# EAGLE schematic bdm80 (EAGLE 9.6.2)
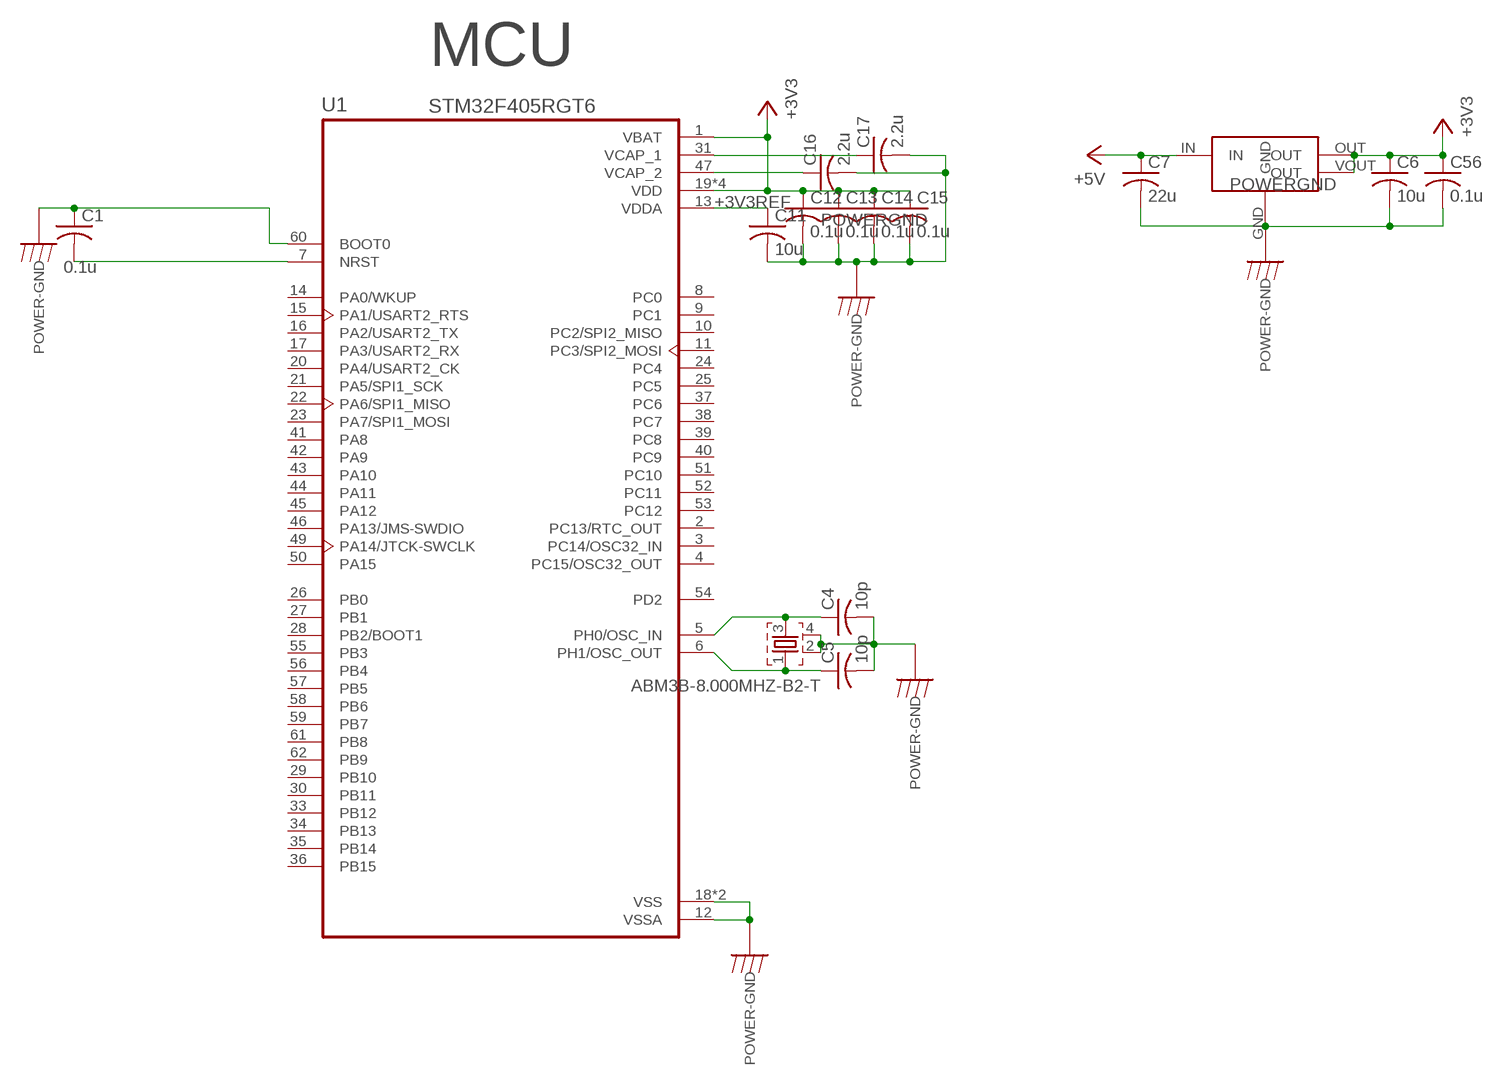
[diagram p0: schematic, sheet 1]

## Parts
C1  0.1u  C-2012  [2012-C]
C4  10p  C-1608  [1608]
C5  10p  C-1608  [1608]
C6  10u  C-2012  [2012-C]
C7  22u  C-2012  [2012-C]
C11  10u  C-2012  [2012-C]
C12  0.1u  C-2012  [2012-C]
C13  0.1u  C-2012  [2012-C]
C14  0.1u  C-2012  [2012-C]
C15  0.1u  C-2012  [2012-C]
C16  2.2u  C-2012  [2012-C]
C17  2.2u  C-2012  [2012-C]
C56  0.1u  C-2012  [2012-C]
IC1  AZ1086H-3.3  [SOT223]
U1  STM32F405RGT6  [LQFP64]
X1  ABM3B-8.000MHZ-B2-T  [ABM3B-8.000MHZ-B2-T]

## Nets
+3V3: C6.1 C12.1 C13.1 C14.1 C15.1 C56.1 IC1.OUT IC1.VOUT(OUT) U1.1(VBAT) U1.19(VDD) U1.32(VDD) U1.48(VDD) U1.64(VDD)
+3V3REF: C11.1 U1.13(VDDA)
+5V: C7.1 IC1.IN
N$17: C4.1 U1.5(PH0/OSC_IN) X1.3
N$18: C5.1 U1.6(PH1/OSC_OUT) X1.1
N$24: C16.1 U1.47(VCAP_2)
N$25: C17.1 U1.31(VCAP_1)
NRST: C1.2 U1.7(NRST)
POWER-GND: C1.1 C4.2 C5.2 C6.2 C7.2 C11.2 C12.2 C13.2 C14.2 C15.2 C16.2 C17.2 C56.2 IC1.GND U1.12(VSSA) U1.18(VSS) U1.60(BOOT0) U1.63(VSS) X1.2 X1.4 ; supply symbol labelled POWERGND
Unconnected: U1.2(PC13/RTC_OUT) U1.3(PC14/OSC32_IN) U1.4(PC15/OSC32_OUT) U1.8(PC0) U1.9(PC1) U1.10(PC2/SPI2_MISO) U1.11(PC3/SPI2_MOSI) U1.14(PA0/WKUP) U1.15(PA1/USART2_RTS) U1.16(PA2/USART2_TX) U1.17(PA3/USART2_RX) U1.20(PA4/USART2_CK) U1.21(PA5/SPI1_SCK) U1.22(PA6/SPI1_MISO) U1.23(PA7/SPI1_MOSI) U1.24(PC4) U1.25(PC5) U1.26(PB0) U1.27(PB1) U1.28(PB2/BOOT1) U1.29(PB10) U1.30(PB11) U1.33(PB12) U1.34(PB13) U1.35(PB14) U1.36(PB15) U1.37(PC6) U1.38(PC7) U1.39(PC8) U1.40(PC9) U1.41(PA8) U1.42(PA9) U1.43(PA10) U1.44(PA11) U1.45(PA12) U1.46(PA13/JMS-SWDIO) U1.49(PA14/JTCK-SWCLK) U1.50(PA15) U1.51(PC10) U1.52(PC11) U1.53(PC12) U1.54(PD2) U1.55(PB3) U1.56(PB4) U1.57(PB5) U1.58(PB6) U1.59(PB7) U1.61(PB8) U1.62(PB9)

## Notes on the sheet
- MCU

## Library data of the parts
C1 C4-C7 C11-C17 C56 = Passive_Robotech:C
IC1 = IC_Robotech:AZ1086?-*
U1 = MicroControler_Robotech:STM32F405RGT6: High-performance foundation line, ARM Cortex-M4 core with DSP and FPU, 1 Mbyte Flash, 168 MHz CPU, ART Accelerator; DESCRIPTION: High-performance foundation line, ARM Cortex-M4 core with DSP and FPU, 1 Mbyte Flash, 168 MHz CPU, ART Accelerator; DIGI-KEY_PART_NUMBER: 497-11767-ND; DIGI-KEY_PURCHASE_URL: https://www.digikey.jp/product-detail/en/stmicroelectronics/STM32F405RGT6/497-11767-ND/2754208?utm_source=snapeda&utm_medium=aggregator&utm_campaign=symbol; MF: STMicroelectronics; MP: STM32F405RGT6; PACKAGE: LQFP-64 STMicroelectronics
X1 = Passive_Robotech:ABM3B-8.000MHZ-B2-T